# EAGLE schematic GT Sensor Theo (EAGLE 9.6.2)
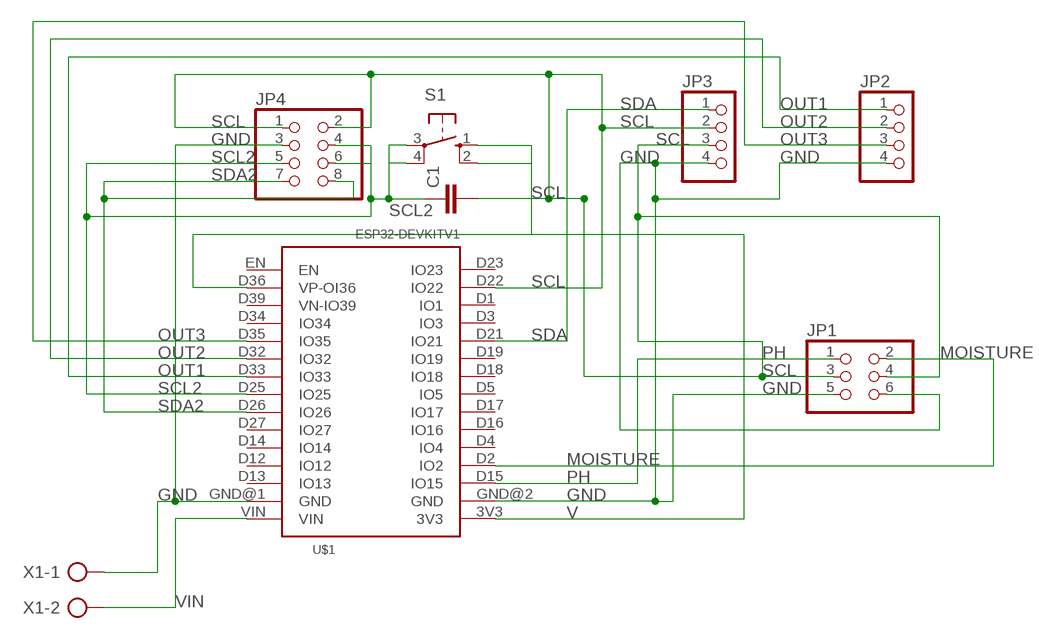
[diagram p0: schematic, sheet 1]

## Parts
C1  C-EU050-030X075  [C050-030X075]
JP1  PINHD-2X3  [2X03]
JP2  PINHD-1X4  [1X04]
JP3  PINHD-1X4  [1X04]
JP4  PINHD-2X4  [2X04]
S1  10-XX  [B3F-10XX]
U$1  ESP32DEVKITV1  [ESP32-DEVKITV1]
X1  AK300/2  [AK300/2]

## Nets
GND: JP1.5 JP1.6 JP2.4 JP3.4 JP4.3 S1.4(P1) U$1.GND@1(GND) U$1.GND@2(GND) X1.1
MOISTURE: JP1.2 U$1.D2(IO2)
N$1: JP4.6
OUT1: JP2.1 U$1.D33(IO33)
OUT2: JP2.2 U$1.D32(IO32)
OUT3: JP2.3 U$1.D35(IO35)
PH: JP1.1 U$1.D15(IO15)
SCL: C1.2 JP1.3 JP1.4 JP3.2 JP3.3 JP4.1 JP4.2 U$1.D22(IO22)
SCL2: C1.1 JP4.4 JP4.5 S1.3(P) U$1.D25(IO25)
SDA: JP3.1 U$1.D21(IO21)
SDA2: JP4.7 JP4.8 U$1.D26(IO26)
V: S1.1(S) S1.2(S1) U$1.3V3 U$1.D36(VP-OI36)
VIN: U$1.VIN X1.2
Unconnected: U$1.D1(IO1) U$1.D3(IO3) U$1.D4(IO4) U$1.D5(IO5) U$1.D12(IO12) U$1.D13(IO13) U$1.D14(IO14) U$1.D16(IO16) U$1.D17(IO17) U$1.D18(IO18) U$1.D19(IO19) U$1.D23(IO23) U$1.D27(IO27) U$1.D34(IO34) U$1.D39(VN-IO39) U$1.EN

## Library data of the parts
C1 = rcl:C-EU: CAPACITOR, European symbol; SPICEPREFIX: C
JP1 = pinhead:PINHD-2X3: PIN HEADER
JP2 JP3 = pinhead:PINHD-1X4: PIN HEADER
JP4 = pinhead:PINHD-2X4: PIN HEADER
S1 = switch-omron:10-XX: OMRON SWITCH; MPN: B3F-1000; OC_FARNELL: 176432; OC_NEWARK: 36M3542
U$1 = esp32-devkitv1:ESP32DEVKITV1
X1 = con-ptr500:AK300/2: CONNECTOR; OC_FARNELL: unknown; OC_NEWARK: unknown